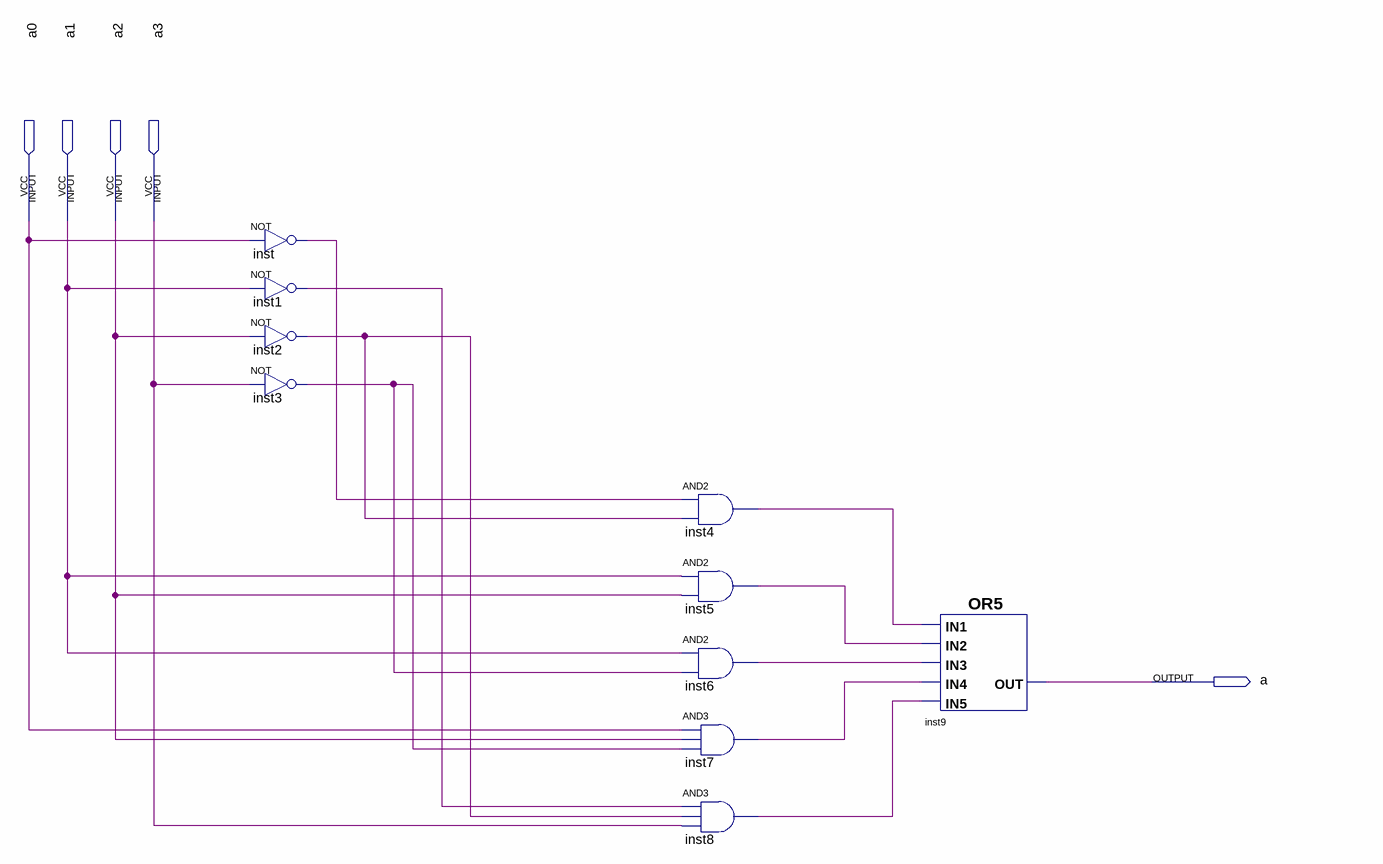
[diagram p0: schematic sheet]
// Quartus schematic A.bdf as structural Verilog: 10 symbols, 5 pins
module A (
  input  a0,
  input  a1,
  input  a2,
  input  a3,
  output a
);

  wire inst1_out, inst2_out, inst3_out, inst4_out, inst5_out, inst6_out, inst7_out, inst8_out, inst_out;

  not inst (inst_out, a0);
  not inst1 (inst1_out, a1);
  not inst2 (inst2_out, a2);
  not inst3 (inst3_out, a3);
  and inst4 (inst4_out, inst_out, inst2_out);
  and inst5 (inst5_out, a1, a2);
  and inst6 (inst6_out, a1, inst3_out);
  and inst7 (inst7_out, a0, a2, inst3_out);
  and inst8 (inst8_out, inst1_out, inst2_out, a3);
  or inst9 (a, inst4_out, inst5_out, inst6_out, inst7_out, inst8_out);
endmodule
